# Altium project PCB_Project_LDO1.PrjPcb
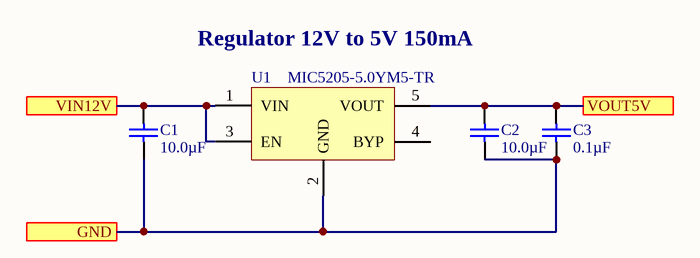
[diagram p0: LDO_12V-5V.SchDoc]
1 sheet, 4 parts. Net scope: flat (ports and power ports of the same name join across sheets).
Board file: LDO_12V-5V.PcbDoc

## Sheet LDO_12V-5V.SchDoc
size Letter

### Parts
C1  value 10.0µF  [PCB-j0jk5xr8qbnaskonccg4-1]  (hidden comment: C3225X7R1E106K250AC)
C2  value 10.0µF  [PCB-j0jk5xr8qbnaskonccg4-1]  (hidden comment: C3225X7R1E106K250AC)
C3  value 0.1µF  [PCB-mhhqftc5ilnrg4qi8ds6-1]  (hidden comment: CL10B104KB8NNNC)
U1  MIC5205-5.0YM5-TR  [SOT-23-5_N]

### Ports
GND, VIN12V, VOUT5V

### Nets
NetC1_1: C1.1 C2.1 C3.1 U1.2(GND) ; port GND
NetC1_2: C1.2 U1.1(VIN) U1.3(EN) ; port VIN12V
NetC2_2: C2.2 C3.2 U1.5(VOUT) ; port VOUT5V

Not connected (* = marked no-connect by the designer): U1 4(BYP)

### Notes on the sheet
- Regulator 12V to 5V 150mA

### Library data of the parts
C1 C2 = CMP-2bdce35de069f41b-1: CAP CER 10uF ±10% 25V X7R 1210; Manufacturer: TDK; Case/Package: 1210; OctopartID: 2bdce35de069f41b; Octopart URL: http://octopart.com/c3225x7r1e106k250ac-tdk-25947859; ManufacturerPartNumber: C3225X7R1E106K250AC; Mounting Type: SMT; Type: X7R; Supplier 1: Digi-Key; Supplier Part Number 1: 445-3942-1-ND
C3 = CMP-1af8d38ac64bc53f-5: CAP CER 0.1uF 50V X7R 0603; Manufacturer: Samsung Electro-Mechanics; Octopart URL: https://octopart.com/cl10b104kb8nnnc-samsung-7928277; OctopartID: 1af8d38ac64bc53f; Mounting Type: SMT; ManufacturerPartNumber: CL10B104KB8NNNC; Type: X7R; Supplier 1: Digi-Key; Supplier Part Number 1: 1276-1000-1-ND
U1 = CMP-6255a8a416e5bd92-5: IC Regulator LDO 5 V Fixed Output 150 mA SOT-23-5; Manufacturer: Microchip; Octopart URL: https://octopart.com/mic5205-5.0ym5-tr-microchip-66802134; ManufacturerPartNumber: MIC5205-5.0YM5-TR; Mounting Type: SMT; Supplier 1: Digi-Key; Supplier Part Number 1: 576-1261-1-ND